# EAGLE schematic T15_PRI_SYS_V1.1 (EAGLE 7.1.0)
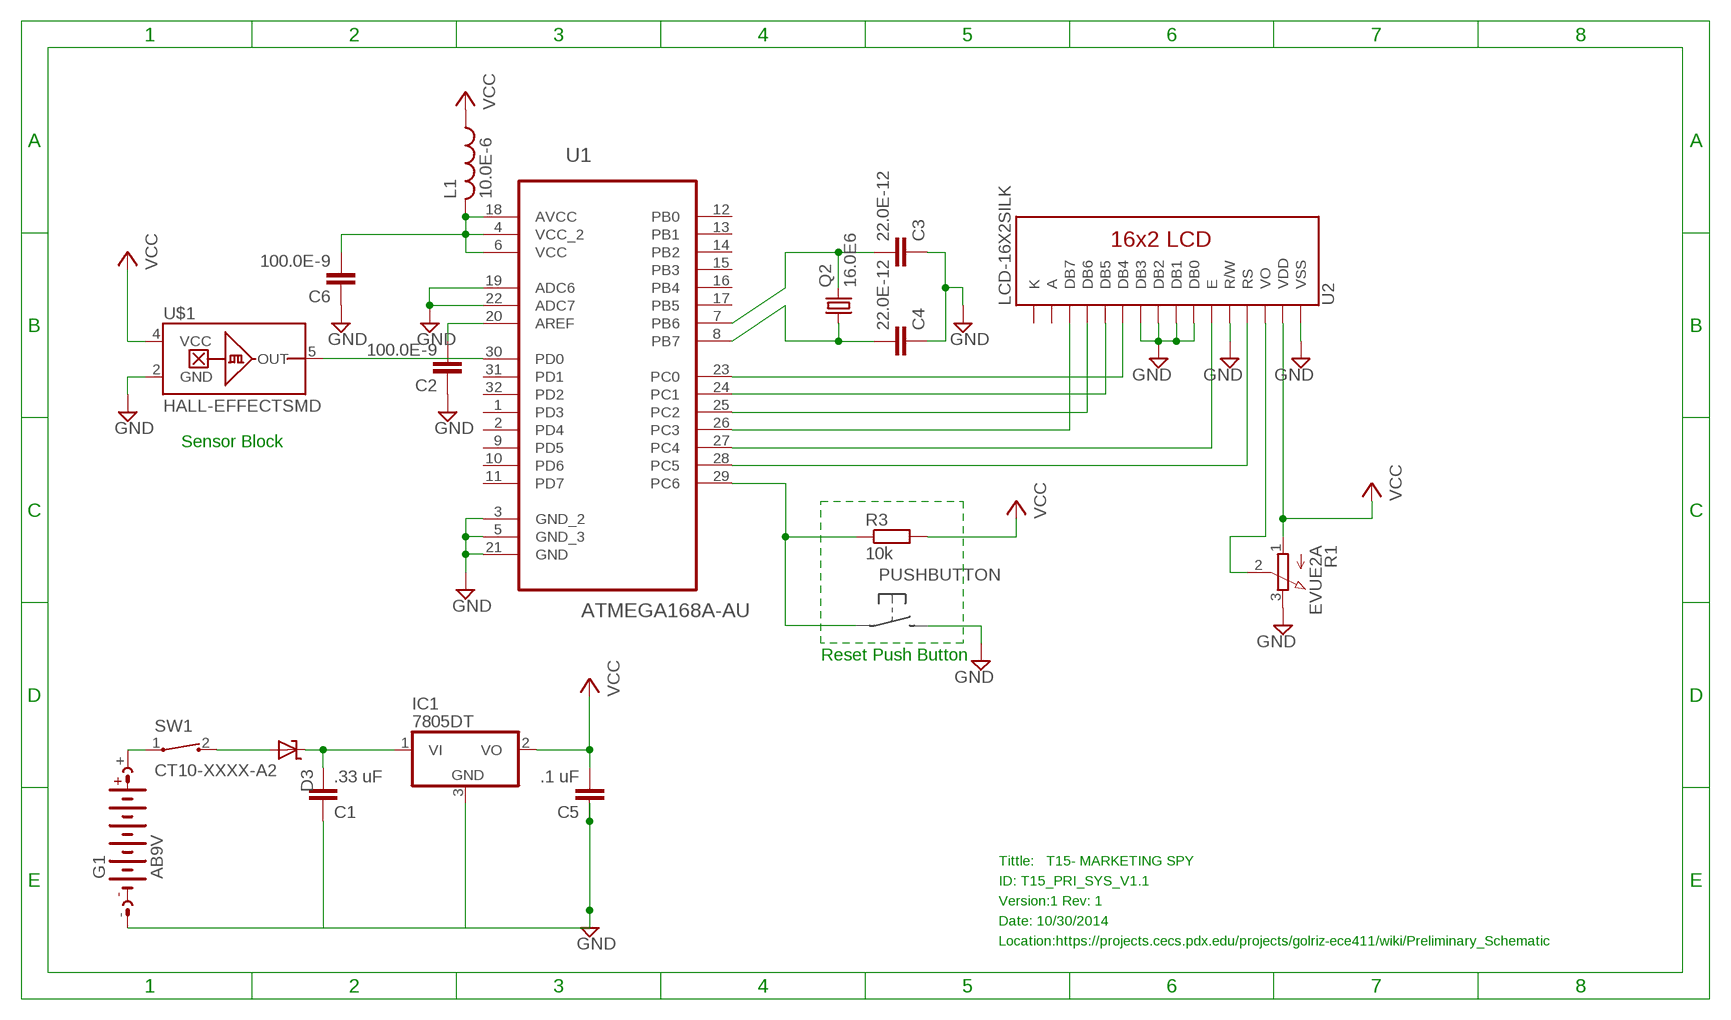
[diagram p0: schematic, sheet 1]

## Parts
C1  .33 uF  C-EU025-024X044  [C025-024X044]
C2  100.0E-9  C-EU025-024X044  [C025-024X044]
C3  22.0E-12  C-EU025-024X044  [C025-024X044]
C4  22.0E-12  C-EU025-024X044  [C025-024X044]
C5  .1 uF  C-EU025-024X044  [C025-024X044]
C6  100.0E-9  C-EU025-024X044  [C025-024X044]
D3  SUPPRESSOR-SMBJ  [SMBJ]
G1  AB9V  [AB9V]
IC1  7805DT  [TO252]
L1  10.0E-6  L-US0204/5  [0204/5]
Q2  16.0E6  CRYSTALHC49S  [HC49/S]
R1  EVUE2A  [EVUE]
R3  10k  R-EU_0204/5  [0204/5]
SW1  CT10-XXXX-A2  [CT10-XXXX-A2]
U1  ATMEGA168A-AU  [QFP80P900X900X120-32N]
U2  LCD-16X2SILK  [LCD-16X2]
U$1  HALL-EFFECTSMD  [SC70]

## Nets
GND: C1.1 C2.1 C3.1 C4.1 C5.1 C6.1 G1.- IC1.3(GND) R1.3(E) U1.3(GND_2) U1.5(GND_3) U1.19(ADC6) U1.21(GND) U1.22(ADC7) U2.1(VSS) U2.5(R/W) U2.7(DB0) U2.8(DB1) U2.9(DB2) U2.10(DB3) U$1.2(GND)
N$1: G1.+ SW1.1
N$5: C1.2 D3.C IC1.1(VI)
N$7: R1.2(S) U2.3(VO)
N$9: U1.23(PC0) U2.11(DB4)
N$10: C4.2 Q2.1 U1.8(PB7)
N$11: U1.24(PC1) U2.12(DB5)
N$12: U1.25(PC2) U2.13(DB6)
N$13: U1.26(PC3) U2.14(DB7)
N$15: C3.2 Q2.2 U1.7(PB6)
N$16: R3.1 U1.29(PC6)
N$17: U1.27(PC4) U2.6(E)
N$18: U1.28(PC5) U2.4(RS)
N$19: U1.30(PD0) U$1.5(OUT)
N$20: D3.A SW1.2
N$22: C6.2 L1.2 U1.4(VCC_2) U1.6(VCC) U1.18(AVCC)
VCC: C5.2 IC1.2(VO) L1.1 R1.1(A) R3.2 U2.2(VDD) U$1.4(VCC)
VCC1: C2.2 U1.20(AREF)
Unconnected: U1.1(PD3) U1.2(PD4) U1.9(PD5) U1.10(PD6) U1.11(PD7) U1.12(PB0) U1.13(PB1) U1.14(PB2) U1.15(PB3) U1.16(PB4) U1.17(PB5) U1.31(PD1) U1.32(PD2)

## Notes on the sheet
- Sensor Block
- Reset Push Button
- Tittle:   T15- MARKETING SPY
  ID: T15_PRI_SYS_V1.1
  Version:1 Rev: 1
  Date: 10/30/2014
  Location:https://projects.cecs.pdx.edu/projects/golriz-ece411/wiki/Preliminary_Schematic

## Power pins joined to a net without a drawn wire
A: U2.15(A)
K: U2.16(K)

## Library data of the parts
C1-C6 = rcl:C-EU: CAPACITOR, European symbol
D3 = diode:SUPPRESSOR-: Suppressor diode
G1 = battery:AB9V: 9-V BATTERY CLIP
IC1 = linear:78*: Positive VOLTAGE REGULATOR Source: http://cache.national.com/ds/LM/LM78L05.pdf http://www.fairchildsemi.com/ds/LM/LM7805.pdf
L1 = rcl:L-US: INDUCTOR, American symbol
Q2 = crystal:CRYSTAL: CRYSTAL; OC_FARNELL: 1667008; OC_NEWARK: unknown
R1 = pot:EVU: 9 mm Square Rotary Potentiometers Source: Panasonic
R3 = rcl:R-EU_: RESISTOR, European symbol
SW1 = switch-coto:CT10-XXXX-: CT10 Series Molded Switch Source: www.cotorelay.com .. Coto_Technology__CT10-1530-G1.pdf
U1 = Atmel_By_element14_Batch_1-00:ATMEGA168A-AU: MCU; DESCRIPTION: MCU; MPN: ATMEGA168A-AU; OC_FARNELL: 1841603; OC_NEWARK: 12T1295; PACKAGE: QFP-32; SUPPLIER: Atmel
U2 = SparkFun-Displays:LCD-16X2: Standard text-only 16x2 parallel input LCD
U$1 = SparkFun-Sensors:HALL-EFFECT: Hall effect sensor in SC70 package